# EAGLE design analog-interface (EAGLE 6.6.0)
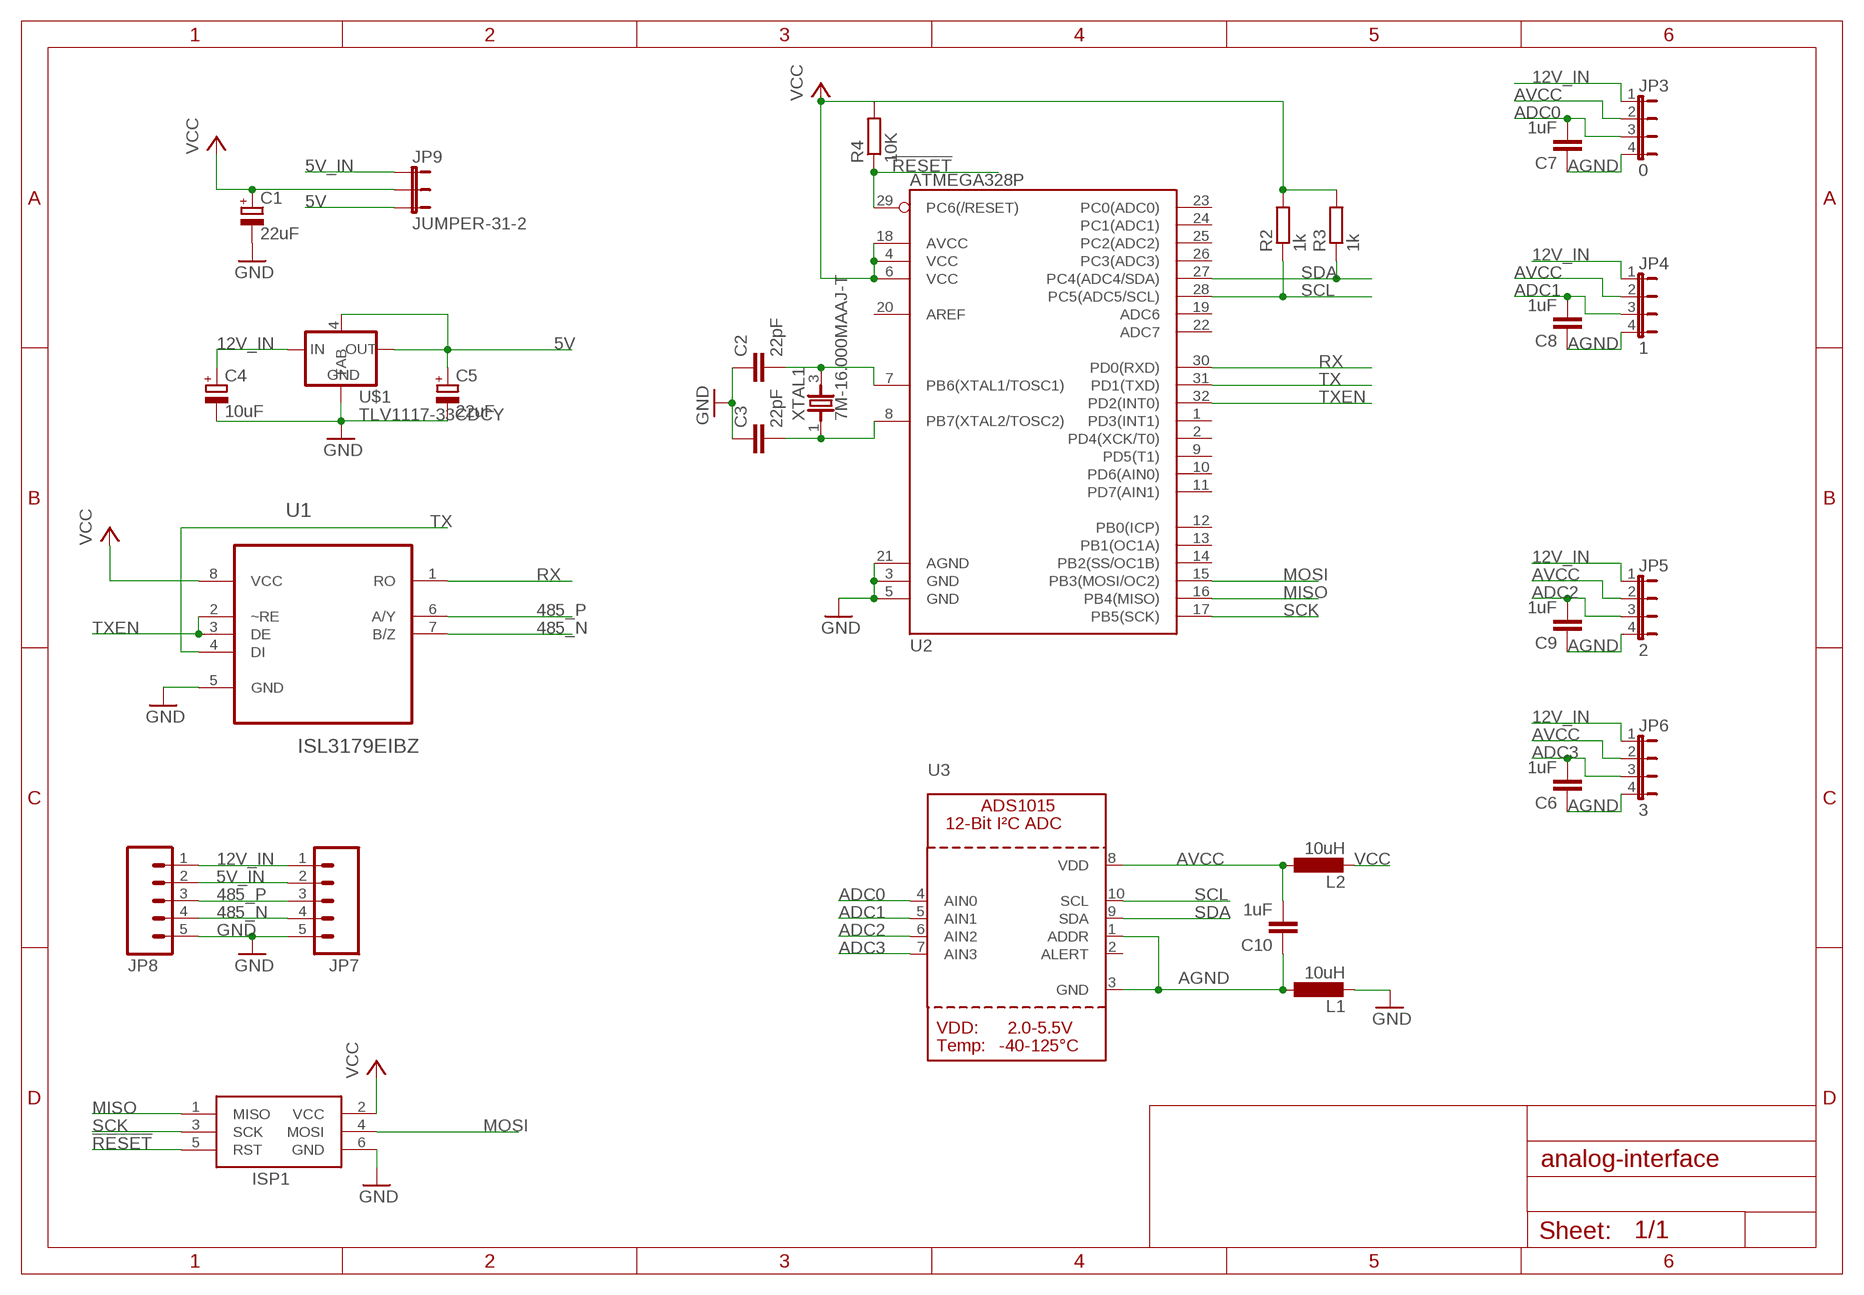
[diagram p0: schematic, sheet 1]

## Parts
C1  22uF  CPOL-EUA/3216-18R  [A/3216-18R]
C2  22pF  C-EUC0805  [C0805]
C3  22pF  C-EUC0805  [C0805]
C4  10uF  CPOL-EUA/3216-18R  [A/3216-18R]
C5  22uF  CPOL-EUA/3216-18R  [A/3216-18R]
C6  1uF  C-EUC0805  [C0805]
C7  1uF  C-EUC0805  [C0805]
C8  1uF  C-EUC0805  [C0805]
C9  1uF  C-EUC0805  [C0805]
C10  1uF  C-EUC0805  [C0805]
ISP1  AVRISP-6  [AVRISP]
JP3  0  JP4E  [JP4]
JP4  1  JP4E  [JP4]
JP5  2  JP4E  [JP4]
JP6  3  JP4E  [JP4]
JP7  M05PTH  [1X05]
JP8  M05PTH  [1X05]
JP9  JUMPER-31-2  [SJ_3_PASTE1&2]
L1  10uH  L-EUL3216C  [L3216C]
L2  10uH  L-EUL3216C  [L3216C]
R2  1k  R-EU_R0805  [R0805]
R3  1k  R-EU_R0805  [R0805]
R4  10K  R-EU_R0805  [R0805]
U1  ISL3179EIBZ  [SOIC127P600X175-8N]
U2  ATMEGA328P  ATMEGA328_SMT  [TQFP32-08]
U3  ADC_ADS1015  [MSOP10]
U$1  TLV1117-33CDCY  [SOT223]
XTAL1  7M-16.000MAAJ-T  [TXC_7M-16.000MAAJ-T]

## Nets
5V: C5.+ JP9.3 U$1.2(OUT) U$1.4(TAB)
5V_IN: JP7.2 JP8.2 JP9.1
12V_IN: C4.+ JP3.1 JP4.1 JP5.1 JP6.1 JP7.1 JP8.1 U$1.3(IN)
485_N [rs485]: JP7.4 JP8.4 U1.7(B/Z)
485_P [rs485]: JP7.3 JP8.3 U1.6(A/Y)
!RESET: ISP1.5(RST) R4.1 U2.29(PC6(/RESET))
ADC0: C7.2 JP3.3 U3.4(AIN0)
ADC1: C8.2 JP4.3 U3.5(AIN1)
ADC2: C9.2 JP5.3 U3.6(AIN2)
ADC3: C6.2 JP6.3 U3.7(AIN3)
AGND: C6.1 C7.1 C8.1 C9.1 C10.1 JP3.4 JP4.4 JP5.4 JP6.4 L1.1 U3.1(ADDR) U3.3(GND)
AVCC: C10.2 JP3.2 JP4.2 JP5.2 JP6.2 L2.1 U3.8(VDD)
GND: C1.- C2.1 C3.1 C4.- C5.- ISP1.6(GND) JP7.5 JP8.5 L1.2 U1.5(GND) U2.3(GND) U2.5(GND) U2.21(AGND) U$1.1(GND)
MISO: ISP1.1(MISO) U2.16(PB4(MISO))
MOSI: ISP1.4(MOSI) U2.15(PB3(MOSI/OC2))
N$2: C2.2 U2.7(PB6(XTAL1/TOSC1)) XTAL1.3
N$3: C3.2 U2.8(PB7(XTAL2/TOSC2)) XTAL1.1
RX: U1.1(RO) U2.30(PD0(RXD))
SCK: ISP1.3(SCK) U2.17(PB5(SCK))
SCL: R2.1 U2.28(PC5(ADC5/SCL)) U3.10(SCL)
SDA: R3.1 U2.27(PC4(ADC4/SDA)) U3.9(SDA)
TX: U1.4(DI) U2.31(PD1(TXD))
TXEN: U1.2(~RE) U1.3(DE) U2.32(PD2(INT0))
VCC: C1.+ ISP1.2(VCC) JP9.2 L2.2 R2.2 R3.2 R4.2 U1.8(VCC) U2.4(VCC) U2.6(VCC) U2.18(AVCC)
Unconnected: U2.1(PD3(INT1)) U2.2(PD4(XCK/T0)) U2.9(PD5(T1)) U2.10(PD6(AIN0)) U2.11(PD7(AIN1)) U2.12(PB0(ICP)) U2.13(PB1(OC1A)) U2.14(PB2(SS/OC1B)) U2.19(ADC6) U2.20(AREF) U2.22(ADC7) U2.23(PC0(ADC0)) U2.24(PC1(ADC1)) U2.25(PC2(ADC2)) U2.26(PC3(ADC3)) U3.2(ALERT)

## Library data of the parts
C1 C4 C5 = resistor:CPOL-EU: POLARIZED CAPACITOR, European symbol
C2 C3 C6-C10 = resistor:C-EU: CAPACITOR, European symbol
ISP1 = adafruit:AVRISP: AVR ISP HEADER Standard 6 pin header for AVR programming
JP3-JP6 = jumper:JP4E: JUMPER
JP7 JP8 = SparkFun-Connectors:M05: Header 5 Standard 5-pin 0.1" header. Use with straight break away headers (SKU : PRT-00116), right angle break away headers (PRT-00553), swiss pins (PRT-00743), machine pins (PRT-00117), and female headers (PRT-00115). Molex polarized connector foot print use with SKU : PRT-08230 with associated crimp pins and housings.
JP9 = SparkFun-Passives:JUMPER-3
L1 L2 = resistor:L-EU: INDUCTOR, European symbol
R2-R4 = resistor:R-EU_: RESISTOR, European symbol
U1 = glacsweb:ISL3179EIBZ: TRANCEIVER; MPN: ISL3179EIBZ; OC_FARNELL: 1439860; OC_NEWARK: 58M7513; PACKAGE: SOIC-8; SUPPLIER: Intersil
U2 = SparkFun-DigitalIC:ATMEGA328_SMT: 32-Pin Atmega328 part Commonly used on Arduino compatible boards Available in QFP and QFN packages TQFP is IC-09069 QFN is non-stock; PROD_ID: IC-09069
U3 = microbuilder:ADC_ADS1015: ADS1015 - 12-bit 4-Channel I2C ADC with Internal PGA VDD: 2.0-5.5V Sampling Rate: 3.3ksps Gain Settings: 2/3, 1, 2, 4, 8, 16 I2C Address: ADDR low = 1001000x, ADDR high = 1001001x Internal Comparator The ADS1015 includes an internal comparator that can be set to output a high-level on ALERT when the conversion results exceeeds a pre-defined upper level, and will deassert itself when the level falls below a pre-defined lower threshold level. It can also be set to windowed mode where the ALERT pin will be asserted if the data exceeds the upper threshold or falls below the lower threshold.
U$1 = basestation:TLV1117-33CDCY: Texas Instruments 3.3v 800mA Voltage Regulator http://uk.farnell.com/texas-instruments/tlv1117-33cdcy/v-reg-ldo-3-3v-0-8a-sot-223-4/dp/1494942 Datasheet: http://focus.ti.com/lit/ds/symlink/tlv1117-33.pdf
XTAL1 = TXC-7M-16.000MAAJ-T:7M-16.000MAAJ-T: CRYSTAL SEAM, 16MHZ, 18PF, SMD; MPN: 7M-16.000MAAJ-T; OC_FARNELL: 1842060; OC_NEWARK: 84R5710; PACKAGE: SMD; SUPPLIER: TXC

## Net classes
1 rs485: width 0.305 mm, clearance 0.254 mm

## Board
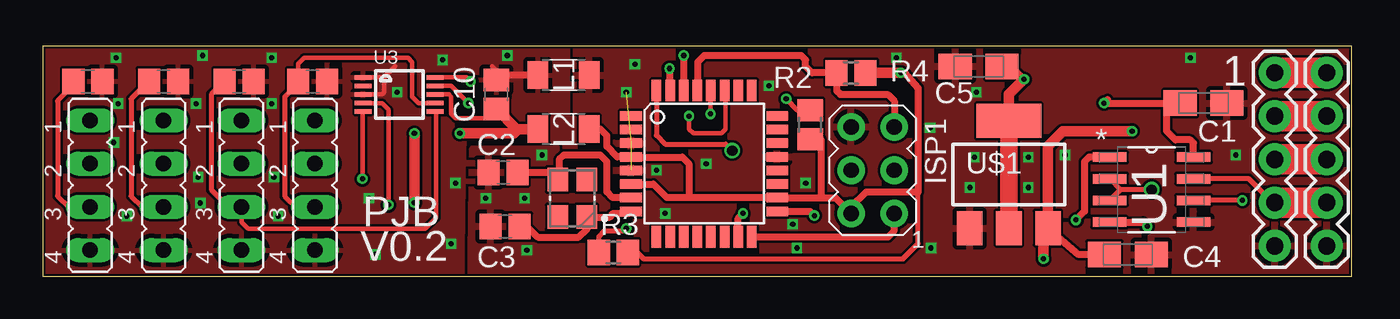
[diagram p1: board, top side]
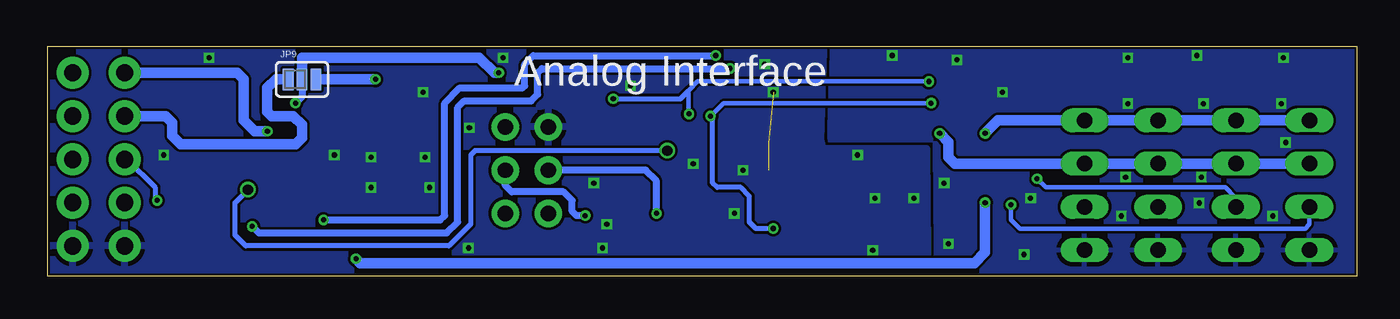
[diagram p2: board, bottom side, seen from below]

Size 76.92 x 13.49 mm. Coordinates in mm from the lower left corner, seen from the top.
Outline: 0,0 76.92,0 76.92,13.49 0,13.49 0,0
Copper layers (1*16): Top 0.035mm / dielectric 1.5mm / Bottom 0.035mm
Design rules "Hackvana *": minimum track width 6mil, minimum drill 0.3mm, track to track 6mil, track to pad 6mil, pad to pad 6mil, via to via 6mil, smd to smd 0mil, copper to edge 6mil, drill to drill 6mil, minimum pad ring 10mil, minimum via ring 6mil, stop-mask expansion 2mil, vias tented up to drill 100mil, thermal gap 10mil

### Footprints (pad centres in the part's own frame; a part is rotated, then mirrored left to right if it is on the bottom)
A/3216-18R = smd 1.95 x 1.5: + 1.375,0; - -1.375,0
C0805 = smd 1.3 x 1.5: 1 -0.85,0; 2 0.85,0
AVRISP = drill 0.9 pad 1.626: 1 -1.27,2.54; 2 1.27,2.54; 3 -1.27,0; 4 1.27,0; 5 -1.27,-2.54; 6 1.27,-2.54
JP4 = drill 0.914 long: 1 -3.81,0; 2 -1.27,0; 3 1.27,0; 4 3.81,0
1X05 = drill 1.016 pad 1.88: 1 0,0; 2 2.54,0; 3 5.08,0; 4 7.62,0; 5 10.16,0
SJ_3_PASTE1&2 = smd 0.635 x 1.27: 1 -0.813,0; 2 0,0; 3 0.813,0
L3216C = smd 1.2 x 1.6: 1 -1.5,0; 2 1.5,0
R0805 = smd 1.3 x 1.5: 1 -0.85,0; 2 0.85,0
SOIC127P600X175-8N = smd 1.981 x 0.559: 1 -2.464,1.905; 2 -2.464,0.635; 3 -2.464,-0.635; 4 -2.464,-1.905; 5 2.464,-1.905; 6 2.464,-0.635; 7 2.464,0.635; 8 2.464,1.905
TQFP32-08 = smd 1.27 x 0.559: 1 -4.293,2.8; 2 -4.293,2; 3 -4.293,1.2; 4 -4.293,0.4; 5 -4.293,-0.4; 6 -4.293,-1.2; 7 -4.293,-2; 8 -4.293,-2.8; 17 4.293,-2.8; 18 4.293,-2; 19 4.293,-1.2; 20 4.293,-0.4; 21 4.293,0.4; 22 4.293,1.2; 23 4.293,2; 24 4.293,2.8 | smd 0.559 x 1.27: 9 -2.8,-4.293; 10 -2,-4.293; 11 -1.2,-4.293; 12 -0.4,-4.293; 13 0.4,-4.293; 14 1.2,-4.293; 15 2,-4.293; 16 2.8,-4.293; 25 2.8,4.293; 26 2,4.293; 27 1.2,4.293; 28 0.4,4.293; 29 -0.4,4.293; 30 -1.2,4.293; 31 -2,4.293; 32 -2.8,4.293
MSOP10 = smd 0.25 x 1: 1 -1,-2.113; 2 -0.5,-2.113; 3 0,-2.113; 4 0.5,-2.113; 5 1,-2.113; 6 1,2.113; 7 0.5,2.113; 8 0,2.113; 9 -0.5,2.113; 10 -1,2.113
SOT223 = smd 1.5 x 2: 1 -2.3,-3.15; 2 0,-3.15; 3 2.3,-3.15 | smd 3.8 x 2: 4 0,3.15
TXC_7M-16.000MAAJ-T = smd 1.4 x 1.2: 1 -1.1,-0.85; 2 1.1,-0.85; 3 1.1,0.85; 4 -1.1,0.85

### Placement (x,y rotation side)
C1  68.2,10.16 180 top
C2  27.05,6.1 0 top
C3  27.18,2.92 0 top
C4  63.75,1.27 180 top
C5  54.99,12.32 0 top
C6  15.88,11.43 180 top
C7  2.67,11.43 180 top
C8  7.11,11.43 180 top
C9  11.56,11.43 180 top
C10  26.67,10.67 270 top
ISP1  48.77,6.22 180 top
JP3  2.79,5.33 270 top
JP4  7.11,5.33 270 top
JP5  11.68,5.33 270 top
JP6  16,5.33 270 top
JP7  75.44,11.94 270 top
JP8  72.39,11.94 270 top
JP9  61.98,11.56 0 bottom
L1  30.61,11.81 0 top
L2  30.61,8.64 0 top
R2  45.09,8.89 270 top
R3  33.53,1.4 0 top
R4  47.5,11.94 0 top
U1  65.15,5.08 0 top
U2  38.86,6.6 0 top
U3  20.96,10.67 270 top
U$1  56.77,5.97 0 top
XTAL1  31.12,4.57 90 top

### Tracks (layer width: path | path; a pad name or v marks a point on that pad's centre or on a via)
5V  (via drill 0.3)
  Top 0.406: C5.+ 56.9,12.32 v57.66,11.56
  Top 0.61: U$1.4 56.77,10.67 v57.66,11.56
  Top 1.016: U$1.4 U$1.2
  Bottom 0.61: v57.66,11.56 JP9.3
5V_IN
  Top 1.778: JP8.2 JP7.2
  Bottom 0.61: JP9.1 63.5,11.56 64.01,11.05 64.01,9.65 63.75,9.4 62.48,9.4 61.98,8.89 61.98,8.13 62.36,7.75 69.09,7.75 69.6,8.25 69.6,9.02 69.98,9.4 JP8.2
12V_IN  (via drill 0.3)
  Top 0.406: C4.+ 60.87,1.27 U$1.3
  Top 0.61: v64.01,8.51 59.94,8.51 59.07,7.63 U$1.3 58.8,2.55 v58.8,1.02 | v21.84,8.38 v21.84,4.32
  Top 1.778: JP7.1 JP8.1
  Bottom 0.61: v64.01,8.51 64.77,8.51 65.41,9.14 65.41,11.56 65.79,11.94 JP8.1 | JP3.1 JP4.1 JP5.1 JP6.1 21.08,9.14 v21.84,8.38 | v21.84,4.32 21.84,1.4 22.48,0.76 58.55,0.76 v58.8,1.02
485_N
  Top 0.305: JP8.4 72.26,4.32 70.87,5.71 U1.7
  Top 1.778: JP7.4 JP8.4
485_P  (via drill 0.3)
  Top 0.305: v70.48,4.45 U1.6
  Top 1.778: JP7.3 JP8.3
  Bottom 0.305: JP8.3 72.26,6.86 70.61,5.21 70.61,4.57 v70.48,4.45
!RESET
  Top 0.406: U2.29 38.48,10.92 38.48,12.57 38.86,12.95 44.58,12.95 44.83,12.7 44.83,12.32 45.21,11.94 R4.1 46.65,10.88 46.86,10.67 49.66,10.67 50.04,10.29 ISP1.5
ADC0  (via drill 0.3)
  Top 0.254: v20.32,4.19 20.32,9.78 19.94,10.16 18.85,10.16 U3.4
  Top 0.305: C7.2 1.82,11.21 0.89,10.29 0.89,4.7 1.52,4.06 JP3.3
  Bottom 0.254: JP3.3 2.79,3.05 3.05,2.79 19.81,2.79 20.32,3.3 v20.32,4.19
ADC1  (via drill 0.3)
  Top 0.254: v18.8,5.71 18.8,9.62 U3.5
  Top 0.305: C8.2 6.22,11.43 5.21,10.41 5.21,4.7 5.84,4.06 JP4.3
  Bottom 0.254: JP4.3 7.11,4.57 7.75,5.21 18.29,5.21 v18.8,5.71
ADC2
  Top 0.254: JP5.3 11.68,3.17 12.07,2.79 22.48,2.79 23.11,3.43 23.11,9.62 U3.6
  Top 0.305: C9.2 10.67,11.43 9.91,10.67 9.91,5.08 10.8,4.19 11.56,4.19 JP5.3
ADC3
  Top 0.254: 15.03,11.34 15.03,12.48 15.37,12.83 21.46,12.83 21.72,12.57 21.72,10.54 22.1,10.16 23.06,10.16 U3.7
  Top 0.305: C6.2 15.03,11.34 14.22,10.54 14.22,4.7 14.86,4.06 JP6.3
AGND  (via drill 0.3)
  Top 0.254: U3.1 19.96,11.67 20.07,11.56 | 20.07,11.56 20.07,10.8 19.94,10.67 U3.3 | 20.07,11.56 20.07,11.68 20.7,12.32 | 26.42,12.32 26.67,12.07 C10.1
  Top 0.406: L1.1 26.96,11.81 C10.1
  other vias: 23.5,12.7 27.3,12.95 20.83,10.8 24.26,5.46 19.18,4.57 19.56,1.27 24,1.9 13.46,12.83 9.4,12.95 4.32,12.83 13.59,5.82 9.14,5.82 9.27,4.29 13.84,3.53 4.95,3.53 4.19,7.85 4.45,10.13 9.02,10.13 13.46,10.13
  pour Top (rank 2): -1.65,18.16 35.81,18.16 35.81,-6.73 -1.65,-6.73 -1.65,17.78
  pour Bottom (rank 2): -0.51,15.88 35.81,15.88 35.81,-4.45 -0.63,-4.45 -0.63,16 -0.51,16 -0.38,16
AVCC  (via drill 0.3)
  Top 0.254: U3.8 23.88,10.67 24,10.54 24,9.52 24.26,9.27 26.92,9.27 27.07,9.42
  Top 0.305: 26.63,9.78 C10.2
  Top 0.406: 27.94,8.64 27.85,8.64 | 27.07,9.42 C10.2
  Top 0.61: v24.51,8.38 27.69,8.38 27.94,8.64 | L2.1 27.85,8.64 C10.2
  Bottom 0.61: v24.51,8.38 24,7.87 24,6.99 23.62,6.6 JP6.2 JP5.2 JP4.2 JP3.2
GND  (via drill 0.3)  (2 unrouted)
  other vias: 60.07,7.11 44.07,3.05 70.1,7.11 67.44,12.83 54.86,10.8 26.04,4.57 28.32,4.57 28.45,1.52 38.99,6.6 54.74,6.99 57.91,6.99 54.48,5.21 57.91,5.21 52.2,1.65 29.34,7.11 36.07,6.22 36.58,3.68 44.83,5.46 42.67,11.18 44.32,1.65 34.29,10.8 34.8,12.45 50.17,12.83 52.15,8.71
  pour Bottom: 31.24,14.99 78.99,17.4 79.25,-2.54 25.15,-4.7 25.27,7.49 31.37,7.49 31.5,8
  pour Top: 25.27,7.49 31.37,7.49 31.37,14.22 32.13,14.99 78.23,15.11 77.85,-0.76 25.15,-0.76
MISO
  Top 0.406: U2.16 49.68,2.31 50.04,2.67 ISP1.1
MOSI  (via drill 0.3)
  Top 0.406: U2.15 40.86,3.4 v41.15,3.68
  Bottom 0.406: v41.15,3.68 41.15,5.59 41.78,6.22 ISP1.4
N$2
  Top 0.406: C2.2 29.71,6.1 XTAL1.3 30.35,5.76 30.35,6.86 30.61,7.11 32.77,7.11 33.15,6.73 33.15,4.95 33.5,4.6 U2.7
N$3
  Top 0.406: U2.8 34.45,3.68 33.53,3.68 33.32,3.47 XTAL1.1 32,3.43 32,2.79 31.5,2.29 29.08,2.29 28.45,2.92 C3.2
RX  (via drill 0.3)
  Top 0.406: U1.1 61.47,6.99 61.21,6.73 61.21,3.81 v60.71,3.3 | v37.67,12.95 U2.30
  Bottom 0.406: v60.71,3.3 53.85,3.3 53.59,3.56 53.59,10.16 52.7,11.05 49.02,11.05 48.9,11.18 48.9,12.45 48.39,12.95 v37.67,12.95
SCK  (via drill 0.3)
  Top 0.406: U2.17 45.09,3.8 v45.34,3.56
  Bottom 0.406: v45.34,3.56 45.85,3.56 46.1,3.81 46.1,4.45 46.61,4.95 49.66,4.95 50.04,5.33 ISP1.3
SCL  (via drill 0.3)
  Top 0.254: U3.10 24.91,11.67 v25.15,11.43 | v39.24,9.52 39.24,10.88 U2.28
  Top 0.305: R2.1 44.36,9.74 v43.69,10.41
  Bottom 0.254: v25.15,11.43 38.73,11.43 U2.28 39.26,9.54 v39.24,9.52
  Bottom 0.305: v43.69,10.41 39.75,10.41 U2.28
SDA  (via drill 0.3)
  Top 0.254: U3.9 24.01,11.17 v25.02,10.16 | U2.27 40.13,10.83 40.13,8.64 39.88,8.38 38.23,8.38 37.97,8.64 v37.97,9.4
  Top 0.305: R3.1 32.68,2.33 33.02,2.67 34.16,2.67 v34.29,2.79
  Bottom 0.254: v25.02,10.16 37.21,10.16 v37.97,9.4
  Bottom 0.305: v34.29,2.79 35.31,2.79 35.69,3.17 35.69,4.7 36.2,5.21 37.59,5.21 37.85,5.46 37.85,9.27 v37.97,9.4
TX  (via drill 0.3)
  Top 0.406: U1.4 64.64,3.17 v64.9,2.92 | v36.83,12.19 36.83,10.93 U2.31
  Bottom 0.406: v64.9,2.92 64.52,2.54 53.47,2.54 52.83,3.17 52.83,9.91 52.45,10.29 48.51,10.29 48.13,10.67 48.13,11.94 47.88,12.19 v36.83,12.19
TXEN  (via drill 0.6)
  Top 0.305: U2.32 36.06,8.26 36.58,7.75 40.13,7.75 v40.51,7.37 | v65.15,5.08 63.32,5.08 | 63.32,5.08 U1.3 | U1.2 63.32,5.08
  Bottom 0.305: v40.51,7.37 51.82,7.37 52.07,7.11 52.07,3.05 53.34,1.78 65.28,1.78 65.91,2.41 65.91,4.32 v65.15,5.08
VCC  (via drill 0.3)
  Top 0.305: 51.31,4.95 51.44,4.83 51.44,1.9 50.55,1.02 35.31,1.02 34.93,1.4 R3.2
  Top 0.406: U1.8 67.62,7.82 67.44,8 66.55,8 66.04,8.51 66.04,10.14 C1.+ v62.36,10.16 62.57,10.38 | U2.6 35.88,5.4 36.68,4.6 38.1,4.6 | 38.1,4.6 U2.18 45.72,4.6 | 45.72,4.6 46.58,4.6 ISP1.2 | 47.5,4.06 48.39,4.95 51.31,4.95 51.44,4.95 51.44,11.05 50.67,11.94 v50.42,11.94 | L2.2 32.77,8.64 33.15,8.25 33.15,7.62 33.76,7 U2.4 34.59,6.99 37.59,6.99 37.97,6.6 37.97,4.73 38.1,4.6 | R2.2 45.72,8.04 45.72,4.6
  Top 0.61: R4.2 v50.42,11.94
  Top 0.813: ISP1.2 47.5,4.06
  Bottom 0.406: JP9.2 61.98,10.54 v62.36,10.16
  Bottom 0.61: v50.42,11.94 50.67,11.94 51.56,12.83 61.98,12.83 JP9.2

### Text on the board
tNames: 1 | PJB | V0.2
bNames: Analog Interface